# EAGLE design BIOGAS (EAGLE 9.6.2)
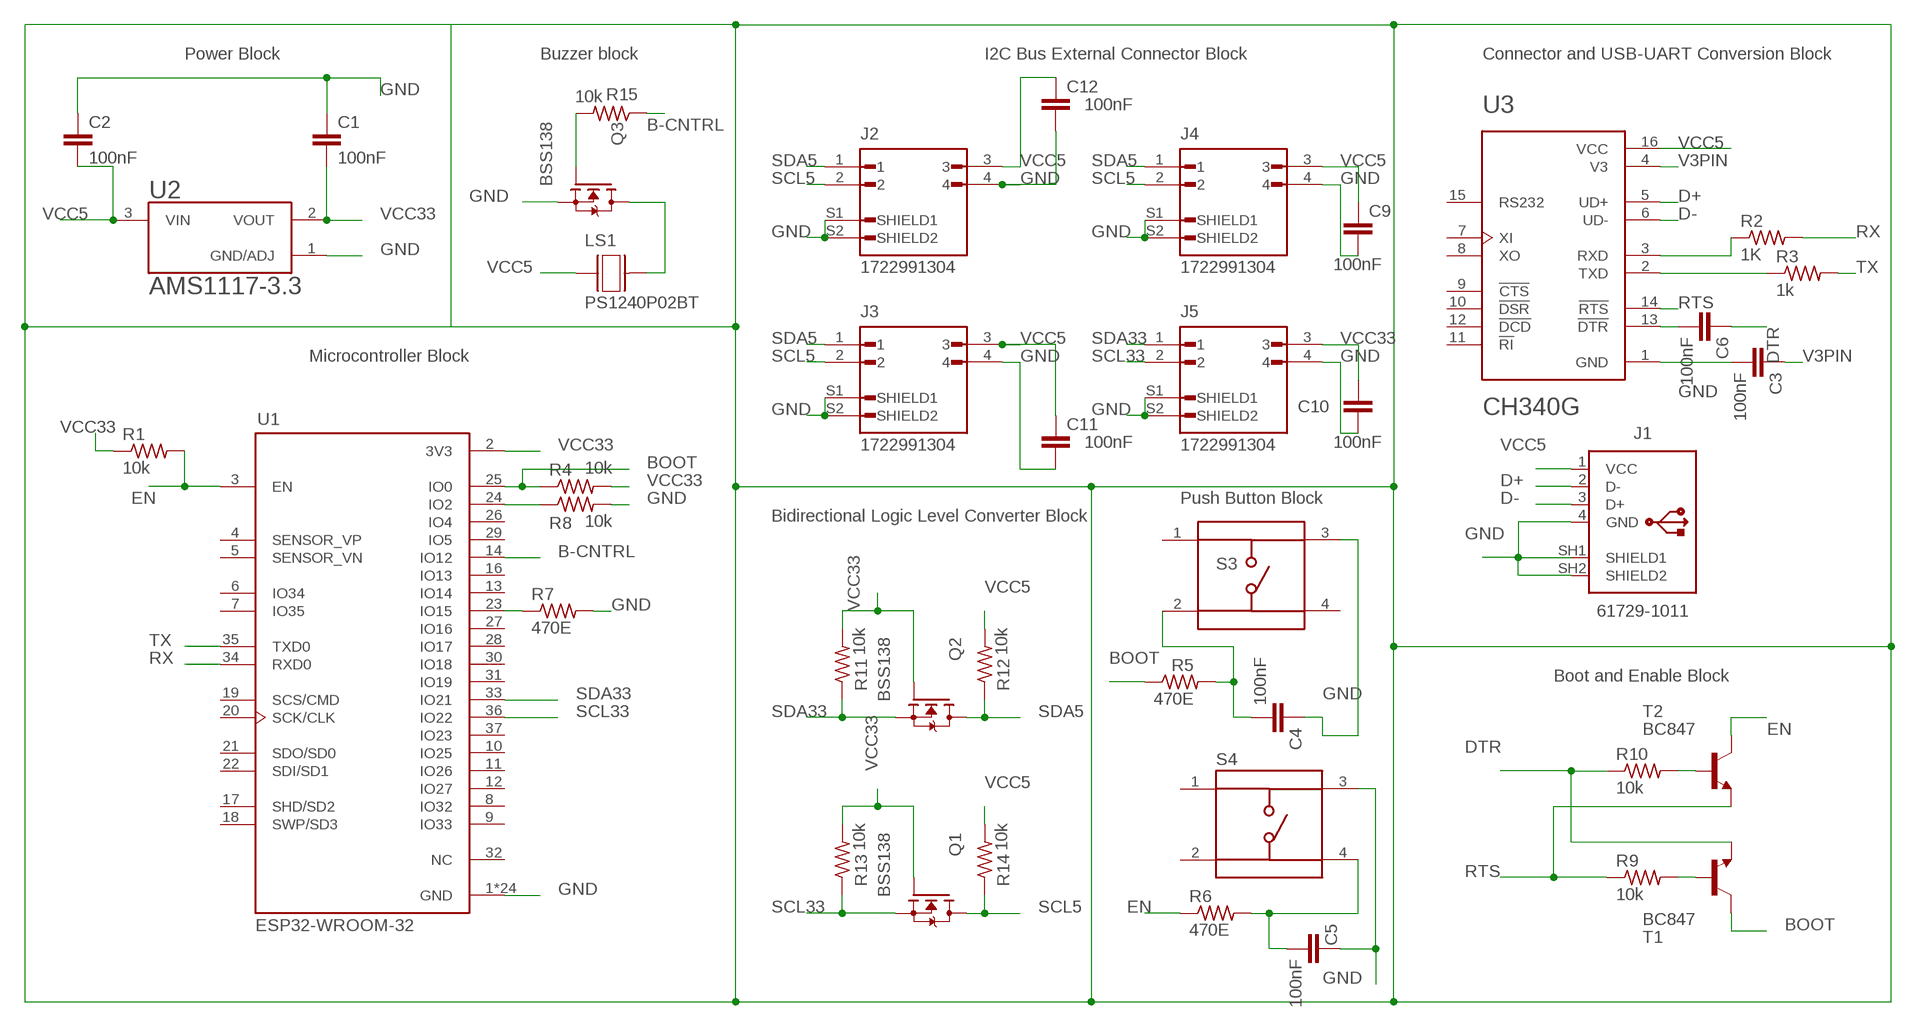
[diagram p0: schematic, sheet 1]

## Parts
C1  100nF  CAPACITOR_SMD_1206  [C1206]
C2  100nF  CAPACITOR_SMD_1206  [C1206]
C3  100nF  CAPACITOR_SMD_1206  [C1206]
C4  100nF  CAPACITOR_SMD_1206  [C1206]
C5  100nF  CAPACITOR_SMD_1206  [C1206]
C6  100nF  CAPACITOR_SMD_1206  [C1206]
C9  100nF  CAPACITOR_SMD_1206  [C1206]
C10  100nF  CAPACITOR_SMD_1206  [C1206]
C11  100nF  CAPACITOR_SMD_1206  [C1206]
C12  100nF  CAPACITOR_SMD_1206  [C1206]
J1  61729-1011  [61729-1011BLF]
J2  1722991304  [MOLEX_1722991304]
J3  1722991304  [MOLEX_1722991304]
J4  1722991304  [MOLEX_1722991304]
J5  1722991304  [MOLEX_1722991304]
LS1  PS1240P02BT  [XDCR_PS1240P02BT]
Q1  BSS138  [SOT95P240X111-3N]
Q2  BSS138  [SOT95P240X111-3N]
Q3  BSS138  [SOT95P240X111-3N]
R1  10k  RESISTOR_SMD_1206  [M1206]
R2  1K  RESISTOR_SMD_1206  [M1206]
R3  1k  RESISTOR_SMD_1206  [M1206]
R4  10k  RESISTOR_SMD_1206  [M1206]
R5  470E  RESISTOR_SMD_1206  [M1206]
R6  470E  RESISTOR_SMD_1206  [M1206]
R7  470E  RESISTOR_SMD_1206  [M1206]
R8  10k  RESISTOR_SMD_1206  [M1206]
R9  10k  RESISTOR_SMD_1206  [M1206]
R10  10k  RESISTOR_SMD_1206  [M1206]
R11  10k  RESISTOR_SMD_1206  [M1206]
R12  10k  RESISTOR_SMD_1206  [M1206]
R13  10k  RESISTOR_SMD_1206  [M1206]
R14  10k  RESISTOR_SMD_1206  [M1206]
R15  10k  RESISTOR_SMD_1206  [M1206]
S3  TS04-66-55-BK-260-SMT  [SW_TS04-66-55-BK-260-SMT]
S4  TS04-66-55-BK-260-SMT  [SW_TS04-66-55-BK-260-SMT]
T1  BC847  [SOT23]
T2  BC847  [SOT23]
U1  ESP32-WROOM-32  [MODULE_ESP32-WROOM-32]
U2  AMS1117-3.3  [SOT229P700X180-4N]
U3  CH340G  [SOIC127P600X180-16N]

## Nets
B-CNTRL: R15.1 U1.14(IO12)
BOOT: R4.1 R5.1 T1.3(C) U1.25(IO0)
D+: J1.2(D-) U3.5(UD+)
D-: J1.3(D+) U3.6(UD-)
DTR: C6.1 R10.1 T1.2(E)
EN: R1.2 R6.1 T2.3(C) U1.3(EN)
GND: C1.1 C2.1 C3.2 C4.1 C5.1 C9.2 C10.2 C11.2 C12.2 J1.4(GND) J1.SH1(SHIELD1) J1.SH2(SHIELD2) J2.4 J2.S1(SHIELD1) J2.S2(SHIELD2) J3.4 J3.S1(SHIELD1) J3.S2(SHIELD2) J4.4 J4.S1(SHIELD1) J4.S2(SHIELD2) J5.4 J5.S1(SHIELD1) J5.S2(SHIELD2) Q3.2(S) R7.2 R8.2 S3.3 S4.3 U1.1(GND) U1.15(GND) U1.38(GND) U1.39_1(GND) U1.39_2(GND) U1.39_3(GND) U1.39_4(GND) U1.39_5(GND) U1.39_6(GND) U1.39_7(GND) U1.39_8(GND) U1.39_9(GND) U1.39_10(GND) U1.39_11(GND) U1.39_12(GND) U1.39_13(GND) U1.39_14(GND) U1.39_15(GND) U1.39_16(GND) U1.39_17(GND) U1.39_18(GND) U1.39_19(GND) U1.39_20(GND) U1.39_21(GND) U2.1(GND/ADJ) U3.1(GND)
N$1: R8.1 U1.24(IO2)
N$2: R2.1 U3.3(RXD)
N$3: R3.1 U3.2(TXD)
N$4: C4.2 R5.2 S3.2
N$5: C5.2 R6.2 S4.4
N$6: R7.1 U1.23(IO15)
N$7: C6.2 U3.13(!DTR)
N$8: R10.2 T2.1(B)
N$9: R9.2 T1.1(B)
N$13: LS1.2 Q3.3(D)
N$14: Q3.1(G) R15.2
RTS: R9.1 T2.2(E) U3.14(!RTS)
RX: R2.2 U1.34(RXD0)
SCL5: J2.2 J3.2 J4.2 Q1.3(D) R14.1
SCL33: J5.2 Q1.2(S) R13.1 U1.36(IO22)
SDA5: J2.1 J3.1 J4.1 Q2.3(D) R12.1
SDA33: J5.1 Q2.2(S) R11.1 U1.33(IO21)
TX: R3.2 U1.35(TXD0)
V3PIN: C3.1 U3.4(V3)
VCC5: C2.2 C9.1 C11.1 C12.1 J1.1(VCC) J2.3 J3.3 J4.3 LS1.1 R12.2 R14.2 U2.3(VIN) U3.16(VCC)
VCC33: C1.2 C10.1 J5.3 Q1.1(G) Q2.1(G) R1.1 R4.2 R11.2 R13.2 U1.2(3V3) U2.2(VOUT)
Unconnected: S3.1 S3.4 S4.1 S4.2 U1.4(SENSOR_VP) U1.5(SENSOR_VN) U1.6(IO34) U1.7(IO35) U1.8(IO32) U1.9(IO33) U1.10(IO25) U1.11(IO26) U1.12(IO27) U1.13(IO14) U1.16(IO13) U1.17(SHD/SD2) U1.18(SWP/SD3) U1.19(SCS/CMD) U1.20(SCK/CLK) U1.21(SDO/SD0) U1.22(SDI/SD1) U1.26(IO4) U1.27(IO16) U1.28(IO17) U1.29(IO5) U1.30(IO18) U1.31(IO19) U1.32(NC) U1.37(IO23) U3.7(XI) U3.8(XO) U3.9(!CTS) U3.10(!DSR) U3.11(!RI) U3.12(!DCD) U3.15(RS232)

## Notes on the sheet
- Power Block | Buzzer block | I2C Bus External Connector Block | Connector and USB-UART Conversion Block
- Microcontroller Block
- Push Button Block
- Bidirectional Logic Level Converter Block
- Boot and Enable Block

## Library data of the parts
C1-C6 C9-C12 = BASIC_Components:CAPACITOR_SMD_1206
J1 = Connector_USB:61729-1011: USB(2.0) Type-B, RCPT, 4POS, THT-R/A Datasheet <https://www.amphenol-icc.com/media/wysiwyg/files/drawing/61729.pdf>; CATEGORY: Connector; CONTACTS: 4; CURRENT_RATING: 1A; DESCRIPTION: CONN RCPT USB2.0 TYPEB 4POS R/A; GENDER: Receptacle; MANUFACTURER: Amphenol ICC (FCI); MOUNT_TYPE: R/A; MPN: 61729-1011BLF; OPERATING_TEMP: -55°C to 85°C; PART_STATUS: Active; ROHS_COMPLIANT: RoHS Compliant; SERIES: 61729; SUB-CATEGORY: USB; TYPE: USB-B
J2-J5 = molex2x2:1722991304; MANUFACTURER: Molex; MAXIMUM_PACKAGE_HEIGHT: 14.0 mm; PARTREV: B8; STANDARD: Manufacturer Recommendations
LS1 = PS1240P02BT-buzzer:PS1240P02BT: Buzzers Transducer, Externally Driven Piezo 3V 4kHz 60dB @ 3V, 10cm Through Hole PC Pins; AVAILABILITY: Unavailable; DESCRIPTION: Buzzers Transducer, Externally Driven Piezo 3V 4kHz 60dB @ 3V, 10cm Through Hole PC Pins; MAXIMUM_PACKAGE_HEIGHT: 7.0mm; MF: TDK; MP: PS1240P02CT3; PACKAGE: SIP-5 TDK; PRICE: None
Q1-Q3 = BSS138:BSS138: N-Channel 50V 220mA (Ta) 360mW (Ta) Surface Mount SOT-23-3; MANUFACTURER: ON Semiconductor; MAXIMUM_PACKAGE_HEIGHT: 1.11 mm; PARTREV: 30 Jan 2018; STANDARD: IPC 7351B
R1-R15 = BASIC_Components:RESISTOR_SMD_1206
S3 S4 = TS04-66-55-BK-260-SMT:TS04-66-55-BK-260-SMT; MANUFACTURER: CUI Devices; PARTREV: 1.0; STANDARD: Manufacturer Recommendations
T1 T2 = BC847:BC847: NPN TRANSISTOR
U1 = ESP32-WROOM-32:ESP32-WROOM-32; MANUFACTURER: Espressif Systems; MAXIMUM_PACKAGE_HEIGHT: 3.2 mm; PARTREV: 2.9; STANDARD: Manufacturer Recommendations
U2 = AMS1117-3.3:AMS1117-3.3; MANUFACTURER: Advanced Monolithic Systems; MAXIMUM_PACKAGE_HEIGHT: 1.8 mm; PARTREV: N/A; SNAPEDA_PACKAGE_ID: 71280; SNAPEDA_PN: AMS1117-3.3; STANDARD: IPC 7351B
U3 = CH340G:CH340G; MANUFACTURER: WCH; MAXIMUM_PACKAGE_HEIGHT: 1.8 mm; PARTREV: 2G; STANDARD: IPC 7351B

## Board
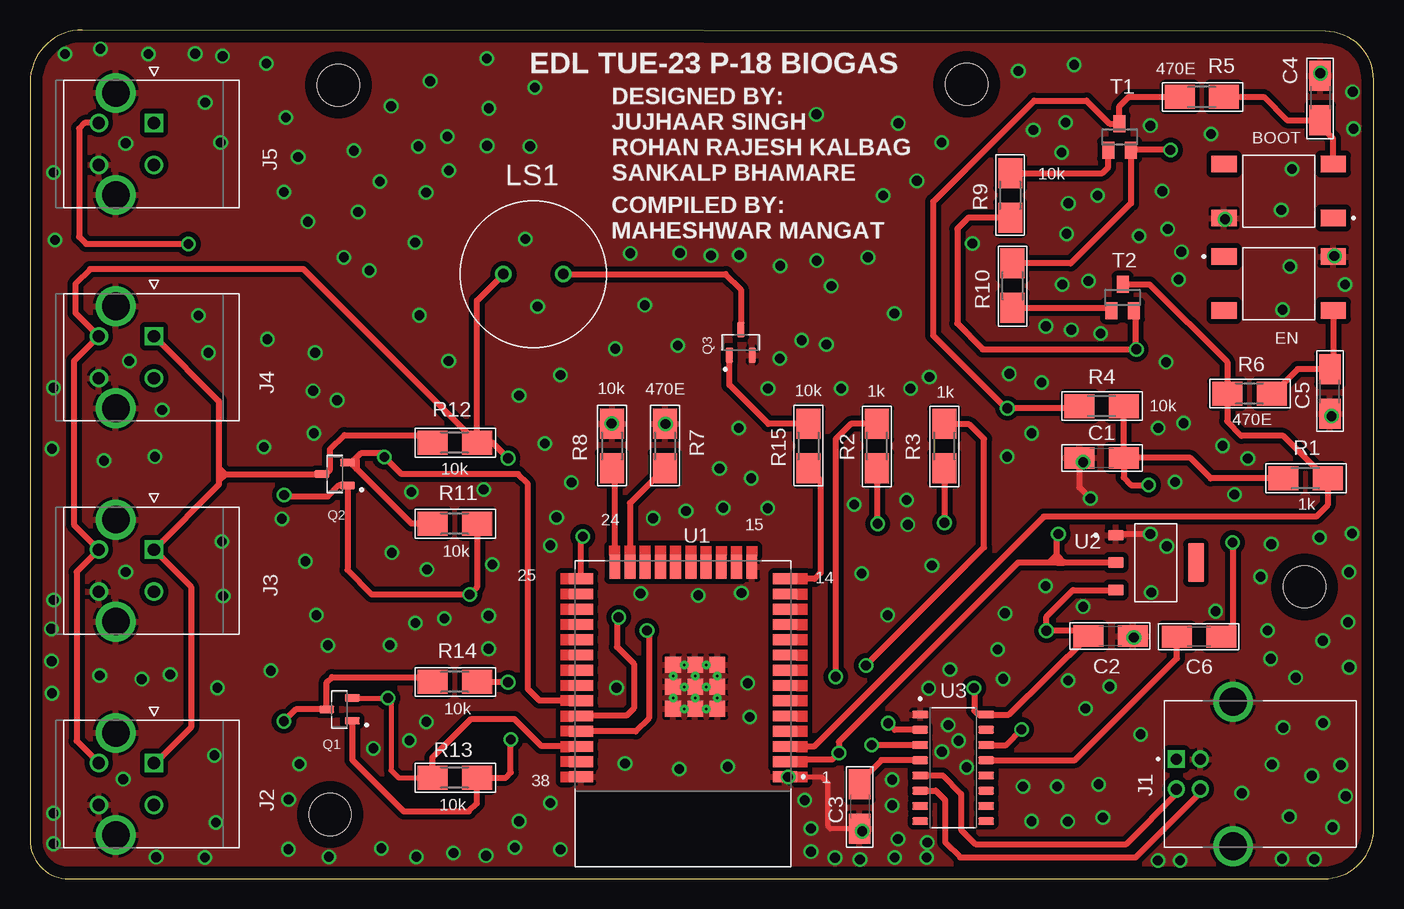
[diagram p1: board, top side]
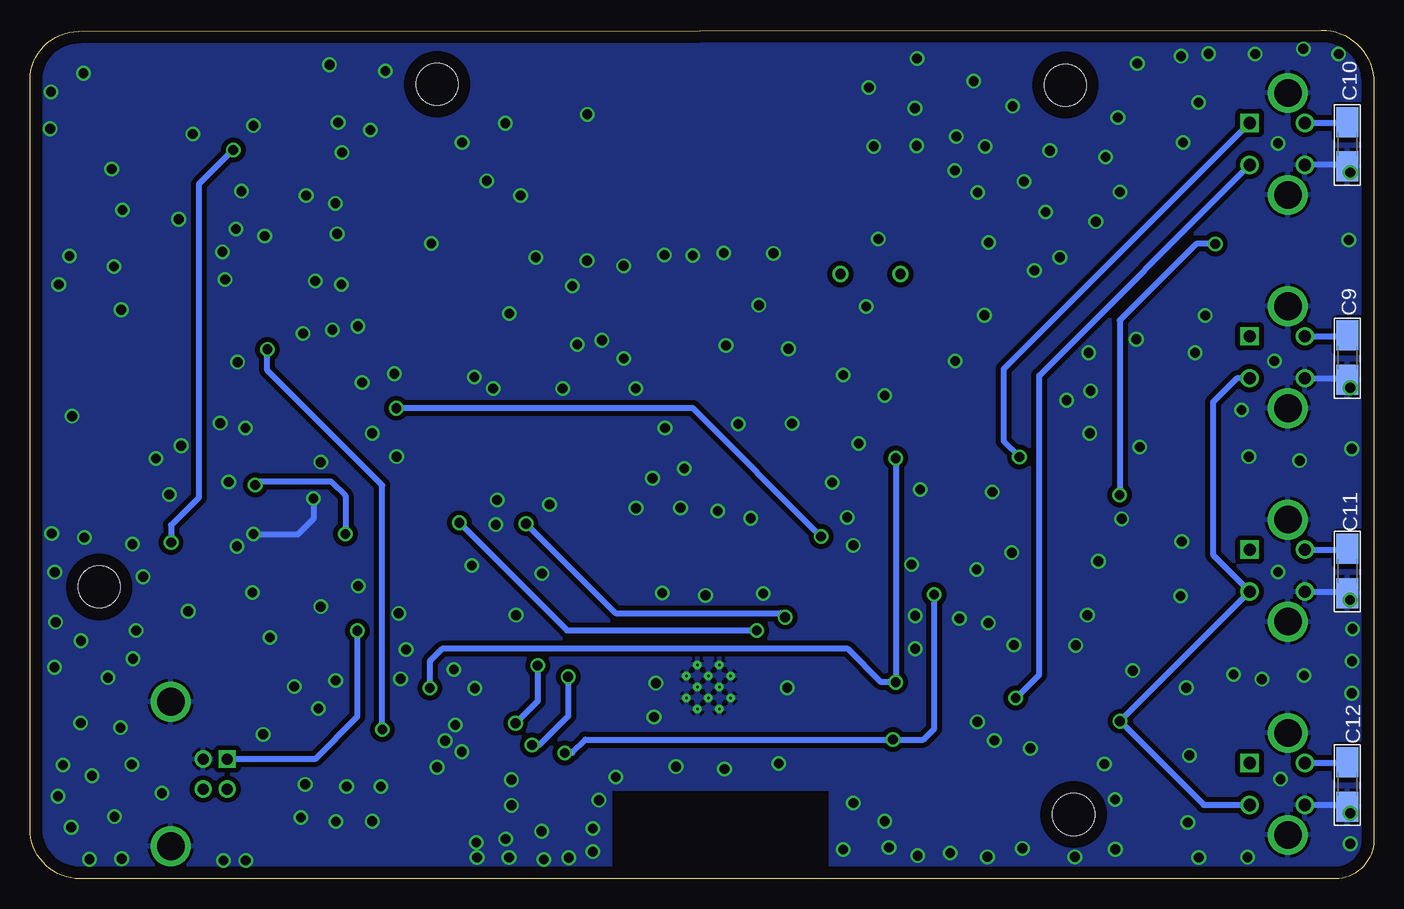
[diagram p2: board, bottom side, seen from below]

Size 112.02 x 70.73 mm. Coordinates in mm from the lower left corner, seen from the top.
Outline: 0,66.37 0,3.23 arc90 3.23,0 107.85,0 arc90 112.02,4.17 112.02,66.57 arc90 107.98,70.62 4.37,70.73 arc90 0,66.37
Copper layers (1*16): Top 0.035mm / dielectric 1.5mm / Bottom 0.035mm
Design rules "default *": minimum track width 16mil, minimum drill 0.25mm, track to track 16mil, track to pad 16mil, pad to pad 16mil, via to via 16mil, smd to smd 16mil, copper to edge 40mil, drill to drill 16mil, minimum pad ring 10mil, minimum via ring 8mil, stop-mask expansion 4mil, vias tented up to drill 20mil, thermal gap 10mil
Holes 3.5 mm at 25.7,66.14 25.02,5.36 106.25,24.33 78.08,66.22

### Footprints (pad centres in the part's own frame; a part is rotated, then mirrored left to right if it is on the bottom)
C1206 = smd 2.5 x 1.8: 1 -1.85,0; 2 1.85,0
61729-1011BLF = drill 0.92 square: 1 1.25,4.71 | drill 0.92: 2 -1.25,4.71; 3 -1.25,2.71; 4 1.25,2.71 | drill 2.3: SH1 -6.02,0; SH2 6.02,0
MOLEX_1722991304 = drill 1.02 pad 1.52 square: 1 0,0 | drill 1.02 pad 1.52: 2 3.5,0; 3 0,-4.6; 4 3.5,-4.6 | drill 2.3 pad 2.8: S1 -2.5,-3.18; S2 6,-3.18
XDCR_PS1240P02BT = drill 0.85 pad 1.28: 1 -2.5,0; 2 2.5,0
SOT95P240X111-3N = smd 1.23 x 0.6: 1 -1.06,0.95; 2 -1.06,-0.95; 3 1.06,0
M1206 = smd 2.5 x 2: 1 -1.85,0; 2 1.85,0
SW_TS04-66-55-BK-260-SMT = smd 2.1 x 1.4: 1 -4.55,2.25; 2 -4.55,-2.25; 3 4.55,2.25; 4 4.55,-2.25
SOT23 = smd 1 x 1.4: 1 -0.95,-1.1; 2 0.95,-1.1; 3 0,1.1
MODULE_ESP32-WROOM-32 = smd 2 x 0.9: 1 -8.5,5.26; 2 -8.5,3.99; 3 -8.5,2.72; 4 -8.5,1.45; 5 -8.5,0.18; 6 -8.5,-1.09; 7 -8.5,-2.36; 8 -8.5,-3.63; 9 -8.5,-4.9; 10 -8.5,-6.17; 11 -8.5,-7.44; 12 -8.5,-8.71; 13 -8.5,-9.98; 14 -8.5,-11.25; 25 8.5,-11.25; 26 8.5,-9.98; 27 8.5,-8.71; 28 8.5,-7.44; 29 8.5,-6.17; 30 8.5,-4.9; 31 8.5,-3.63; 32 8.5,-2.36; 33 8.5,-1.09; 34 8.5,0.18; 35 8.5,1.45; 36 8.5,2.72; 37 8.5,3.99; 38 8.5,5.26 | smd 0.9 x 2: 15 -5.715,-12.25; 16 -4.445,-12.25; 17 -3.175,-12.25; 18 -1.905,-12.25; 19 -0.635,-12.25; 20 0.635,-12.25; 21 1.905,-12.25; 22 3.175,-12.25; 23 4.445,-12.25; 24 5.715,-12.25 | smd 1.33 x 1.33: 39_1 -2.835,-0.405; 39_2 -1,-0.405; 39_3 0.835,-0.405; 39_4 -2.835,-2.24; 39_5 -1,-2.24; 39_6 0.835,-2.24; 39_7 -2.835,-4.075; 39_8 -1,-4.075; 39_9 0.835,-4.075 | drill 0.2 pad 0.3: 39_10 -1.917,-0.405; 39_11 -0.083,-0.405; 39_12 -2.835,-1.323; 39_13 -1,-1.323; 39_14 0.835,-1.323; 39_15 -1.917,-2.24; 39_16 -0.083,-2.24; 39_17 -2.835,-3.158; 39_18 -1,-3.158; 39_19 0.835,-3.158; 39_20 -1.917,-4.075; 39_21 -0.083,-4.075
SOT229P700X180-4N = smd 1.31 x 0.93: 1 -3.345,2.29; 2 -3.345,0; 3 -3.345,-2.29 | smd 1.31 x 3.24: 4 3.345,0
SOIC127P600X180-16N = smd 1.31 x 0.62: 1 -2.75,4.445; 2 -2.75,3.175; 3 -2.75,1.905; 4 -2.75,0.635; 5 -2.75,-0.635; 6 -2.75,-1.905; 7 -2.75,-3.175; 8 -2.75,-4.445; 9 2.75,-4.445; 10 2.75,-3.175; 11 2.75,-1.905; 12 2.75,-0.635; 13 2.75,0.635; 14 2.75,1.905; 15 2.75,3.175; 16 2.75,4.445

### Placement (x,y rotation side)
C1  89.33,35.08 0 top
C2  90.07,20.22 180 top
C3  69.16,6.02 270 top
C4  107.55,65.07 270 top
C5  108.36,40.61 90 top
C6  97.46,20.17 180 top
C9  2.21,43.43 270 bottom
C10  2.21,61.21 270 bottom
C11  2.21,25.65 270 bottom
C12  2.21,7.87 270 bottom
J1  100.28,8.73 90 top
J2  10.34,9.65 270 top
J3  10.34,27.43 270 top
J4  10.34,45.21 270 top
J5  10.34,62.99 270 top
LS1  41.96,50.39 0 top
Q1  25.81,14.12 180 top
Q2  25.4,33.73 180 top
Q3  59.26,44.7 90 top
R1  106.33,33.38 0 top
R2  70.61,36.07 270 top
R3  76.23,36.07 270 top
R4  89.33,39.4 0 top
R5  97.69,65.15 0 top
R6  101.65,40.44 0 top
R7  52.93,36.07 90 top
R8  48.51,36.07 90 top
R9  81.71,56.95 90 top
R10  81.92,49.43 270 top
R11  35.41,29.59 0 top
R12  35.41,36.35 0 top
R13  35.41,8.43 0 top
R14  35.41,16.41 0 top
R15  64.9,36.07 90 top
S3  104.09,57.31 180 top
S4  104.09,49.61 0 top
T1  90.83,61.82 0 top
T2  91.08,48.44 0 top
U1  54.46,13.75 180 top
U2  93.85,26.34 0 top
U3  76.96,9.25 0 top

### Tracks (layer width: path | path; a pad name or v marks a point on that pad's centre or on a via)
B-CNTRL
  Top 0.508: U1.14 65.42,25 65.91,25.49 65.91,33.2 R15.1
BOOT  (via drill 0.81)
  Top 0.508: R5.1 91.58,65.15 90.83,64.4 T1.3 89.99,62.92 88.07,64.85 83.72,64.85 75.31,56.44 75.31,45.26 81.36,39.22 v81.48,39.22 87.3,39.22 R4.1 | U1.25 45.96,28.41 v46.08,28.52
  Bottom 0.508: v46.08,28.52 56.77,39.22 v81.48,39.22
D+
  Top 0.508: U3.5 76.1,8.61 77.62,7.09 77.62,4.09 78.82,2.9 91.39,2.9 95.58,7.08 J1.2
D-
  Top 0.508: U3.6 75.51,7.34 76.28,6.58 76.28,3.05 77.55,1.78 92.17,1.78 97.58,7.18 J1.3
DTR  (via drill 0.81)
  Top 0.508: R10.1 86.77,51.28 91.78,56.29 T1.2 91.81,60.76 95.05,60.76 v95.07,60.73 | v100.25,28.02 100.3,27.97 100.3,21.16 C6.1
  Bottom 0.508: v100.25,28.02 100.25,29.46 97.94,31.77 97.94,57.87 v95.07,60.73
EN
  Top 0.508: T2.3 93.33,49.54 99.8,43.07 R6.1 99.8,38.14 100.99,36.91 104.47,36.91 108,33.38 R1.2 108.18,31.14 107.21,30.18 84.51,30.18 65.35,11.01 62.98,11.01 U1.3
GND  (via drill 0.81)
  Top 0.406: C3.2 66.72,4.17 66.52,4.37 66.52,7.95 65.98,8.49 U1.1
  Top 0.508: C1.1 87.48,32.61 v88.39,31.7 | v93.4,28.73 93.37,28.7 90.58,28.7 U2.1
  Bottom 0.508: J5.4 2.39,59.49 C10.2 | J4.4 2.34,41.71 C9.2 | J2.4 2.34,6.15 C12.2 | J3.4 2.34,23.93 C11.2 | v88.39,31.7 88.39,30 89.66,28.73 v93.4,28.73
  other vias: 27,60.68 33.35,66.47 42.09,65.94 34.8,61.85 33.02,57.2 27.36,55.58 32.11,53.04 32.46,46.96 23.16,54.76 14.61,64.69 14.05,46.94 19.79,44.96 14.88,43.84 8.28,43.15 11.02,39.07 23.6,40.67 19.51,35.99 10.41,35.18 6.17,34.85 21.01,30 22.96,26.47 23.88,21.97 30.18,27.18 16,28.12 16.1,23.57 7.98,25.58 5.82,16.94 9.32,16.64 15.62,15.93 20.09,17.35 24.84,19.46 22.45,9.58 15.37,10.29 15.49,4.7 7.77,8.31 21.54,2.46 21.56,6.6 29.29,2.54 35.31,2.16 40.77,4.8 44.22,2.44 34.54,21.69 33.1,25.78 45.14,33.02 43.89,30.12 43.38,27.79 42.93,36.27 40.77,40.28 44.22,41.99 48.79,44.17 51.26,47.8 54,44.45 34.9,43.15 28.3,50.7 30.1,64.39 38.07,68.35 38.25,64.21 50.04,52.12 56.77,51.94 62.53,51.08 66.4,44.53 72.06,47.12 69.85,51.79 65.58,51.51 59.13,51.99 54.18,52.15 71.12,56.95 72.39,62.97 65.56,63.7 76,61.37 82.4,67.31 87.05,67.84 83.64,62.41 86.56,56.29 94.84,54.15 94.39,57.3 95.99,52.25 88.24,49.81 86.06,49.53 78.56,52.93 94.72,43.05 84.33,41.35 74.98,41.81 66.8,49.4 64.34,44.88 83.49,37.13 73.08,31.57 68.71,31.19 61.49,30.89 57.78,30.91 51.94,30.05 57.48,34.19 59.08,37.57 59.84,16.31 49.61,9.6 54.13,9.14 58.17,9.35 59.99,13.49 48.9,15.93 50.9,23.77 55.7,23.62 59.31,23.83 43.38,6.32 40.41,2.62 31.62,11.53 28.63,10.87 31.8,32.23 37.82,32.44 25.6,39.88 23.77,43.84 23.67,37.13 21.16,57.23 22.35,60.15 21.34,63.45 15.9,61.37 26.16,51.79 29.16,58.12 34.92,59.03 41.68,61.04 38.1,61.09 32.38,61.04 41.3,53.31 42.32,47.7 69.34,25.45 73.18,29.51 75.18,26.11 71.5,21.97 81.46,35.18 81.13,16.66 80.67,19.1 81.28,22.12 76.68,17.45 76.56,12.83 77.42,11.51 78.08,9.3 76.02,10.59 82.78,7.7 85.62,7.7 89.08,7.87 89.43,5.11 86.51,4.78 83.49,4.8 74.75,1.78 72.36,3.33 69.37,3.96 72.09,1.78 69.19,1.6 67.11,1.75 65.1,2.26 65.1,4.19 64.59,6.55 87.99,14.2 86.54,16.54 89.99,16.03 92.58,12.04 104.98,5.18 103.53,9.53 107.8,12.98 109.68,6.88 109.98,17.63 105.51,16.76 103.17,20.7 103.48,27.89 102.59,25.17 110.21,28.78 95.45,33.07 100.41,32.03 101.52,35.03 99.42,36.09 96.16,37.97 94.06,37.57 87.78,34.72 99.62,54.97 107.57,67.13 108.51,38.56 92.02,20.12 84.66,24.41 87.78,22.68 93.47,23.85 94.77,27.71 98.83,22.3 109.96,25.55 109.88,21.39 107.77,19.84 107.49,28.45 11.68,17.02 1.83,15.47 1.8,18.14 1.78,20.83 1.98,23.24 1.96,5.46 1.83,35.84 1.96,40.92 1.96,58.85 104.42,47.42 105.03,51.03 104.32,55.73 105.21,59.16 98.45,62.08 93.4,62.76 86.33,63.02 86,60.53 92.46,53.57 95.76,49.94 89,56.95 86.41,53.75 73.94,58.17 52.98,37.9 48.49,37.95 63.2,8.48 16.05,68.55 13.77,68.76 9.88,68.73 5.87,69.16 2.92,68.73 7.98,61.29 2.08,53.24 1.96,2.92 24.92,1.83 14.58,1.78 10.52,1.8 32.21,1.83 38.02,1.93 95.89,1.52 94.03,1.52 104.37,1.68 107.06,1.63 109.27,9.47 104.47,12.6 106.86,8.59 108.58,4.29 101.02,7.14 103.43,18.34 60.12,33.38 110.26,65.58 110.34,62.51 109.63,49.53 108.74,51.89 19.71,67.94 54.69,30.66 62.51,43.36 67.61,40.87 61.52,40.87 73.41,40.87 81.64,42.09 84.68,46.05 86.82,45.75 89.26,45.44 74.93,15.88 71.88,8.26 71.88,6.12 74.8,3.02 33.05,13.08 30,19.48 32.13,21.31 38.23,19.18 38.23,21.92 38.53,26.19
  pour Top: 1.05,0.48 110.33,0.48 111.4,1.55 111.4,69.52 110.92,70 0.69,70 0.58,69.9 0.58,0.94
  pour Bottom: 0.61,70 111.56,70 111.56,0.51 0.61,0.51
N$1
  Top 0.508: U1.24 48.74,33.99 R8.1
N$2  (via drill 0.81)
  Top 0.508: U3.3 72.57,11.15 72.56,11.16 v70.16,11.16 | v67.16,16.84 67.16,36.64 68.43,37.92 R2.1
  Bottom 0.508: v67.16,16.84 67.16,13.55 69.55,11.16 v70.16,11.16
N$3  (via drill 0.81)
  Top 0.508: v69.7,17.78 79.53,27.61 79.53,36.65 78.31,37.87 76.22,37.87 R3.1 | v71.54,12.97 72.08,12.42 U3.2
  Bottom 0.508: v71.54,12.97 69.7,14.81 v69.7,17.78
N$4
  Top 0.508: R5.2 102.85,65.15 104.78,63.23 C4.2 107.55,62.77 108.64,61.67 S3.2
N$5
  Top 0.508: R6.2 103.65,40.44 105.68,42.47 C5.2 108.64,42.75 S4.4
N$6
  Top 0.508: U1.23 50.01,31.3 R7.1
N$7
  Top 0.508: U3.13 87.12,9.88 95.61,18.37 C6.2
N$8
  Top 0.508: R10.2 89.89,47.58 T2.1
N$9
  Top 0.508: R9.2 89.38,58.8 89.88,59.3 T1.1
N$13
  Top 0.508: LS1.2 57.98,50.39 59.26,49.12 Q3.3
N$14
  Top 0.508: Q3.1 58.31,41.16 61.55,37.92 R15.2
RTS  (via drill 0.81)
  Top 0.508: R9.1 78.24,55.1 77.29,54.15 77.29,46.28 79.44,44.13 79.43,44.12 v92.23,44.12 92.18,44.17 92.18,47.19 T2.2 | U3.14 81.36,11.15 v82.65,12.45
  Bottom 0.508: v82.65,12.45 82.65,32.79 92.23,42.37 v92.23,44.12
RX  (via drill 0.81)
  Top 0.508: R2.2 70.61,29.64 v70.66,29.59 | U1.34 45.99,13.61 49.73,13.61 50.34,14.22 50.34,17.91 48.92,19.33 48.92,21.64 v49.07,21.79
  Bottom 0.508: v70.66,29.59 63.22,22.15 49.43,22.15 v49.07,21.79
SCL5  (via drill 0.81)
  Top 0.508: v21.16,13.13 22.15,14.12 Q1.3 24.75,16.38 25.18,16.82 33.15,16.82 R14.1
  Bottom 0.508: 21.02,12.99 14.18,6.15 J2.2 | J4.2 11.43,41.71 13.41,39.73 13.41,27 J3.2 10.38,23.93 21.02,13.3 21.02,12.99 | 21.02,12.99 v21.16,13.13
SCL33  (via drill 0.81)
  Top 0.406: R13.1 33.53,8.41 30.73,8.41 30.1,9.04 30.1,14.81 v29.84,15.06 Q1.2
  Top 0.508: U1.36 45.91,11.08 42.61,11.08 40.36,13.34 36.78,13.34 33.56,10.11 R13.1 | Q1.2
  Bottom 0.508: J5.2 27.89,41.94 27.89,17.02 v29.84,15.06
SDA5
  Top 0.508: R12.1 32.92,36.98 26.21,36.98 25.01,35.78 25.01,34.09 24.65,33.73 Q2.3 16.31,33.73 | J4.1 15.75,39.8 15.75,34.27 | 15.75,34.27 15.75,33.63 | 15.75,33.63 15.75,33.17 | 15.75,33.17 15.75,32.84 J3.1 13.44,24.33 13.44,12.62 10.46,9.65 J2.1 | 15.75,33.63 15.85,33.73 16.28,33.73 | 16.31,33.73 16.28,33.73 | 16.28,33.73 15.75,34.27 | 16.31,33.73 15.75,33.17
SDA33  (via drill 0.81)
  Top 0.508: U1.33 42.46,14.84 41.5,15.8 41.5,32.92 40.69,33.73 30.96,33.73 v29.54,35.15 29.25,35.44 27.57,35.44 27.16,35.04 | R11.1 31.8,29.59 27.23,34.16 | 27.23,34.16 26.76,34.63 | 26.76,34.63 26.68,34.71 26.59,34.62 26.53,34.68 Q2.2 | 27.16,35.04 26.76,34.63 | 27.16,35.04 27.23,34.98 27.23,34.16
  Bottom 0.508: J5.1 30.86,42.47 30.86,36.47 v29.54,35.15
TX  (via drill 0.81)
  Top 0.508: R3.2 v76.22,29.67 | U1.35 45.98,12.29 50.49,12.29 51.59,13.38 51.59,20.55 v51.44,20.7
  Bottom 0.508: v76.22,29.67 67.26,20.7 v51.44,20.7
V3PIN
  Top 0.508: U3.4 70.97,9.88 69.16,8.07 C3.1
VCC5  (via drill 0.81)
  Top 0.508: R14.2 39.83,16.41 v39.85,16.38 | v78.69,15.9 78.72,15.87 78.72,14.02 79.05,13.69 U3.16 81.59,13.69 C2.2 87.77,20.68 v84.73,20.68 84.73,21.84 86.94,24.05 U2.3 | J2.3 3.89,11.5 3.89,25.58 J3.3 3.66,29.51 3.66,43.13 J4.3 3.79,47.16 3.79,49.58 5,50.8 22.8,50.8 R12.2 | R12.2 37.26,48.19 LS1.1 | v39.85,35.05 38.56,36.35 R12.2
  Bottom 0.508: J4.3 2.28,45.21 C9.1 | C11.1 2.27,27.43 J3.3 | J2.3 2.28,9.65 C12.1 | v78.69,15.9 78.69,18.11 77.65,19.15 43.84,19.15 41.07,16.38 v39.85,16.38 v39.85,35.05 | v84.73,20.68 84.73,13.51 88.27,9.98 J1.1
VCC33  (via drill 0.81)
  Top 0.508: C1.2 R4.2 | R1.1 98.43,33.38 96.73,35.08 C1.2 | U2.2 86.21,26.34 | 85.6,26.34 86.21,26.34 | 85.6,26.34 84.94,26.34 | v40.08,11.61 40.08,8.84 39.67,8.43 R13.2 37.26,6.29 36.58,5.61 31.17,5.61 26.87,9.91 Q1.1 | J5.3 4.57,62.99 4.09,62.51 4.09,53.49 4.67,52.91 v13.21,52.91 | v21.18,31.98 21.31,31.85 24.82,31.85 25.75,32.78 Q2.1 26.46,25.72 28.49,23.69 v36.65,23.69 v36.65,23.7 37.26,24.3 R11.2 | 85.6,26.34 85.6,27 | 85.6,27 85.6,28.6 v85.72,28.73 | v93.24,32.82 91.79,32.82 91.18,33.43 C1.2 | 84.94,26.34 85.6,27 | 85.6,27 86.21,26.39 86.21,26.34 | 84.94,26.34 82.37,26.34 67.44,11.4 v67.44,10.49 66.87,9.92 63.12,9.92 U1.2
  Bottom 0.508: J5.3 2.33,62.99 C10.1 | v67.44,10.49 66.83,10.49 65.71,11.61 v40.08,11.61 37.54,11.61 36.63,12.52 36.63,23.67 v36.65,23.7 | v13.21,52.91 14.81,52.91 21.18,46.53 v21.18,31.98 | v85.72,28.73 85.72,31.9 86.94,33.12 92.94,33.12 v93.24,32.82
(copper drawn outside any net)
  shapes: Top area x38

### Text on the board
tNames: EDL TUE-23 P-18 BIOGAS | 470E | BOOT | DESIGNED BY: / JUJHAAR SINGH / ROHAN RAJESH KALBAG / SANKALP BHAMARE | 10k | COMPILED BY: / MAHESHWAR MANGAT | EN | 10k | 470E | 10k | 1k | 1k | 10k | 470E | 10k | 1k | 24 | 15 | 10k | 25 | 14 | 10k | 38 | 1 | 10k
bValues: 10k